# EasyEDA schematic SCH_Manta_2023-12-03.json

## Sheets
1 Sheet_1: TITLE: Sheet_1; REV: 1.0; Date: 2023-11-29; Sheet: 1/1; Drawn By: g173805; Company: Your Company
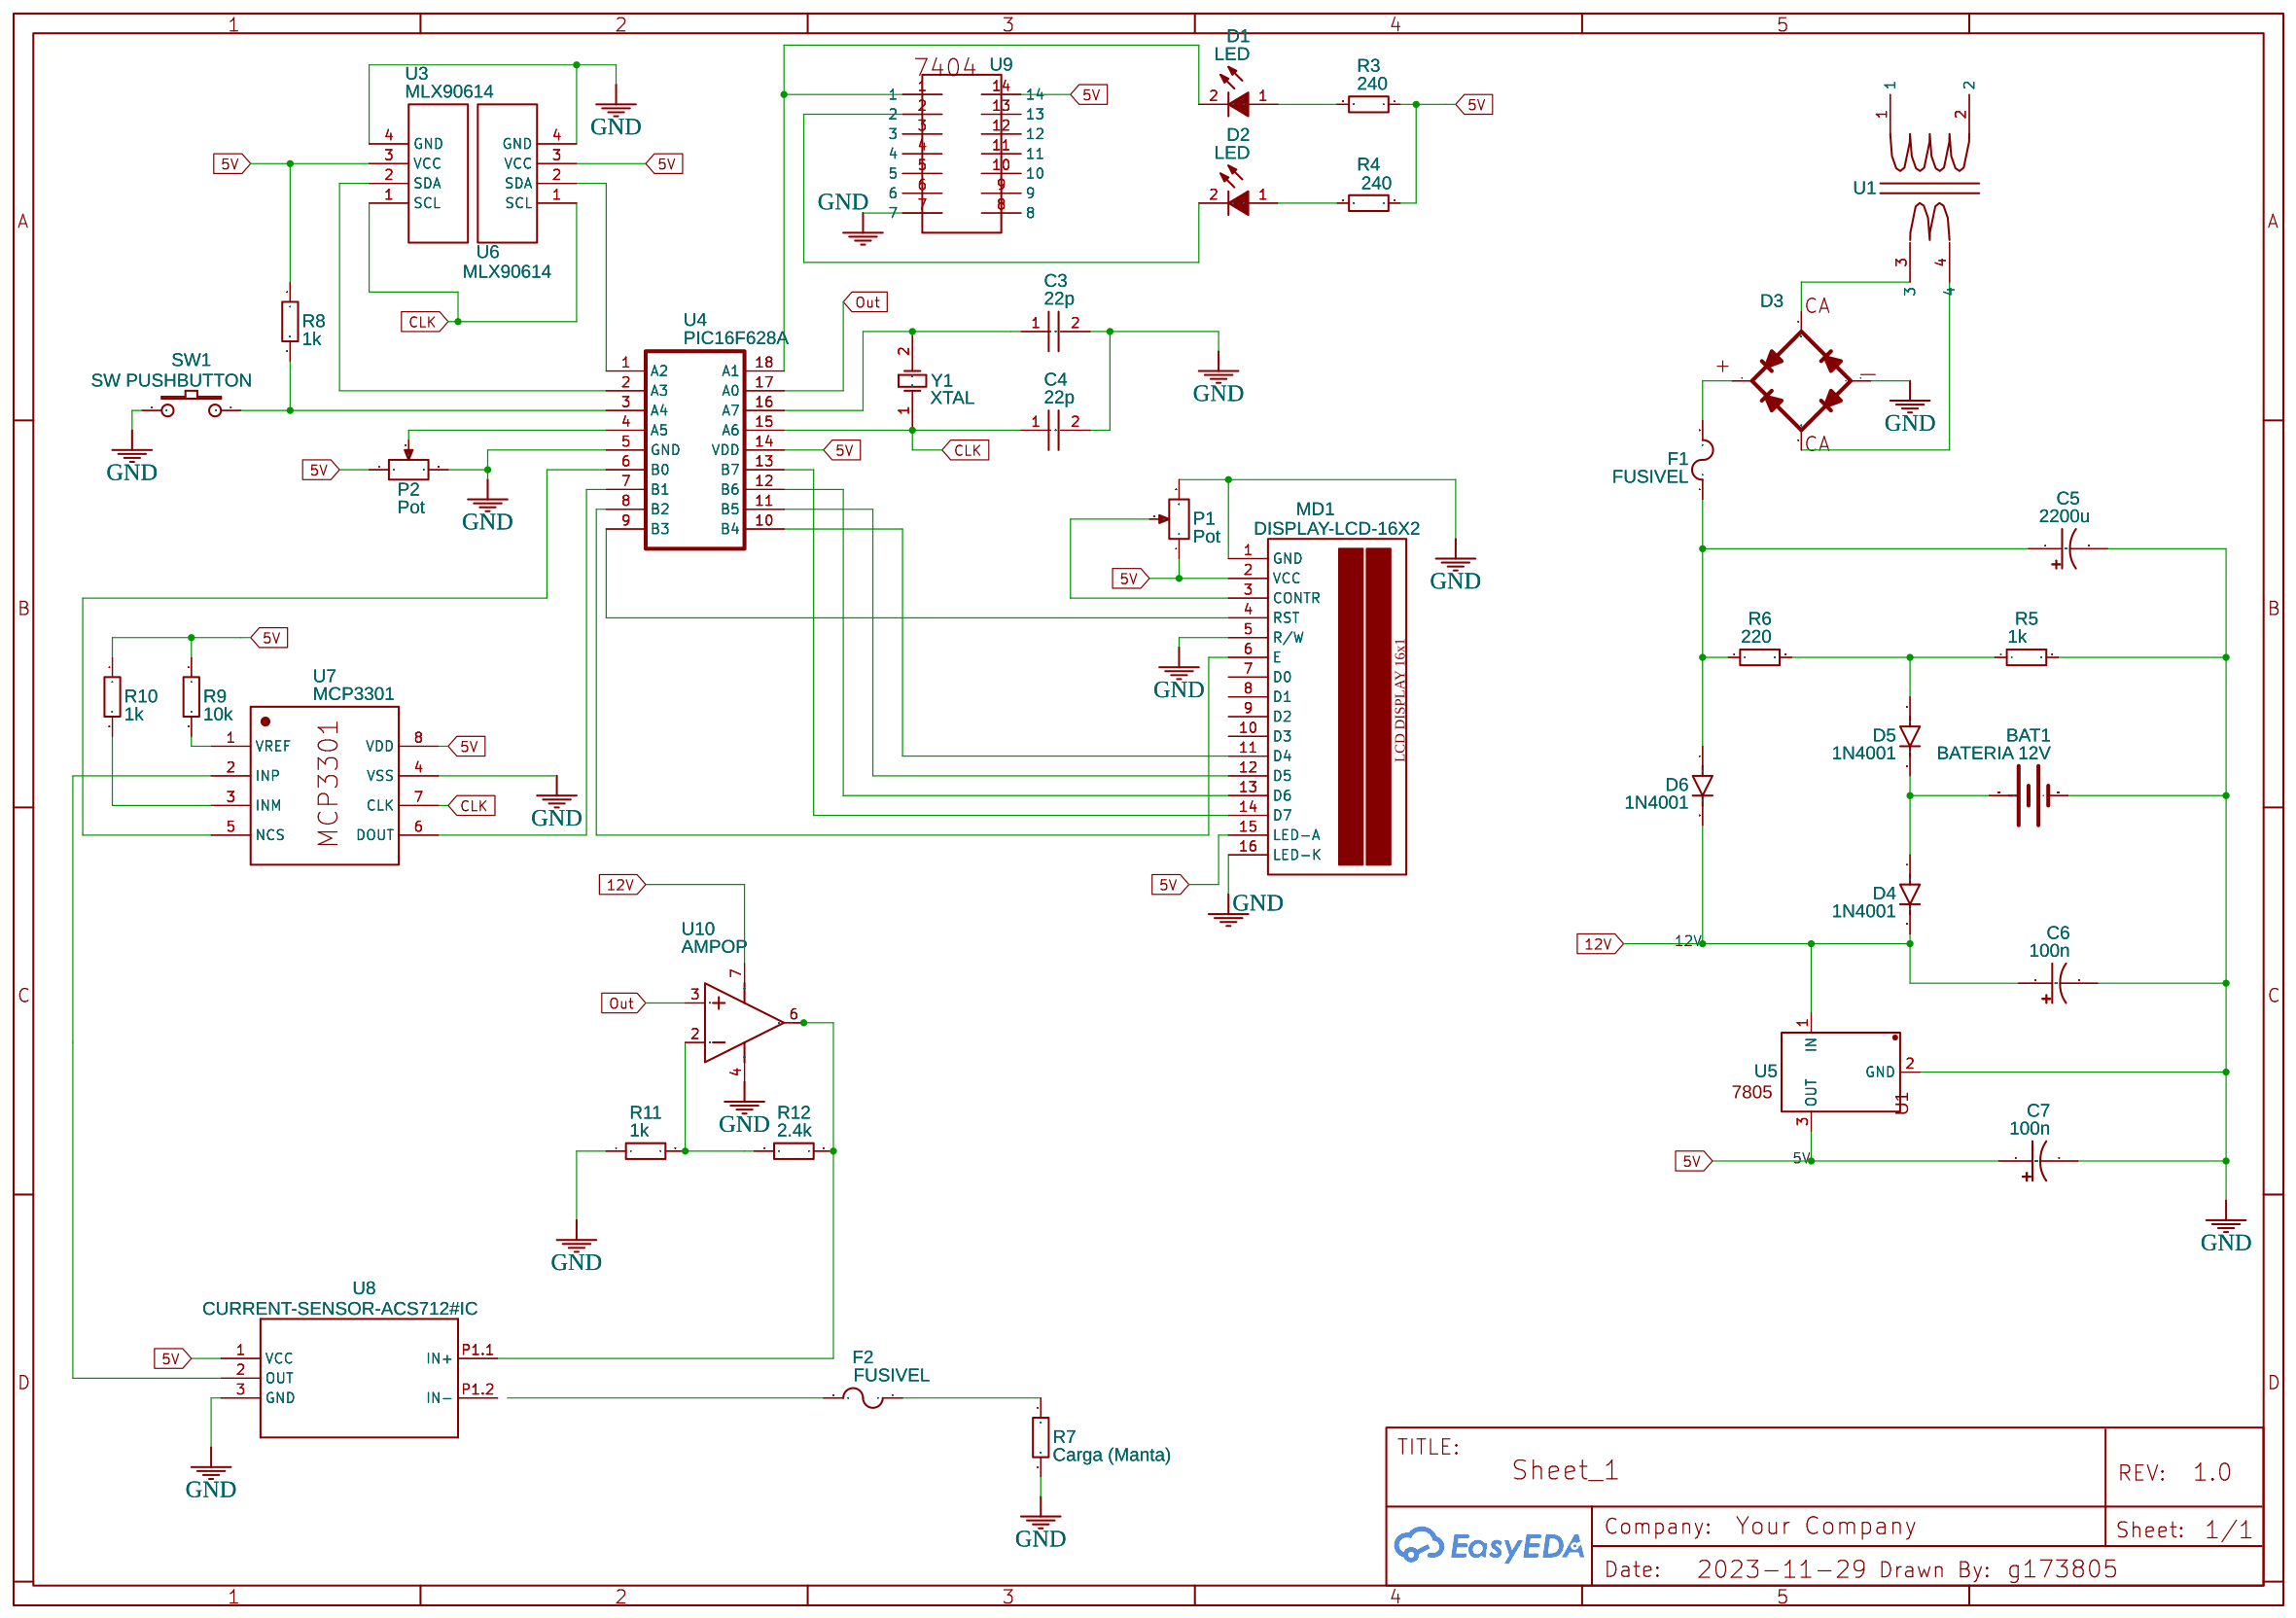
[diagram p0: Sheet_1]
2 Sheet_2
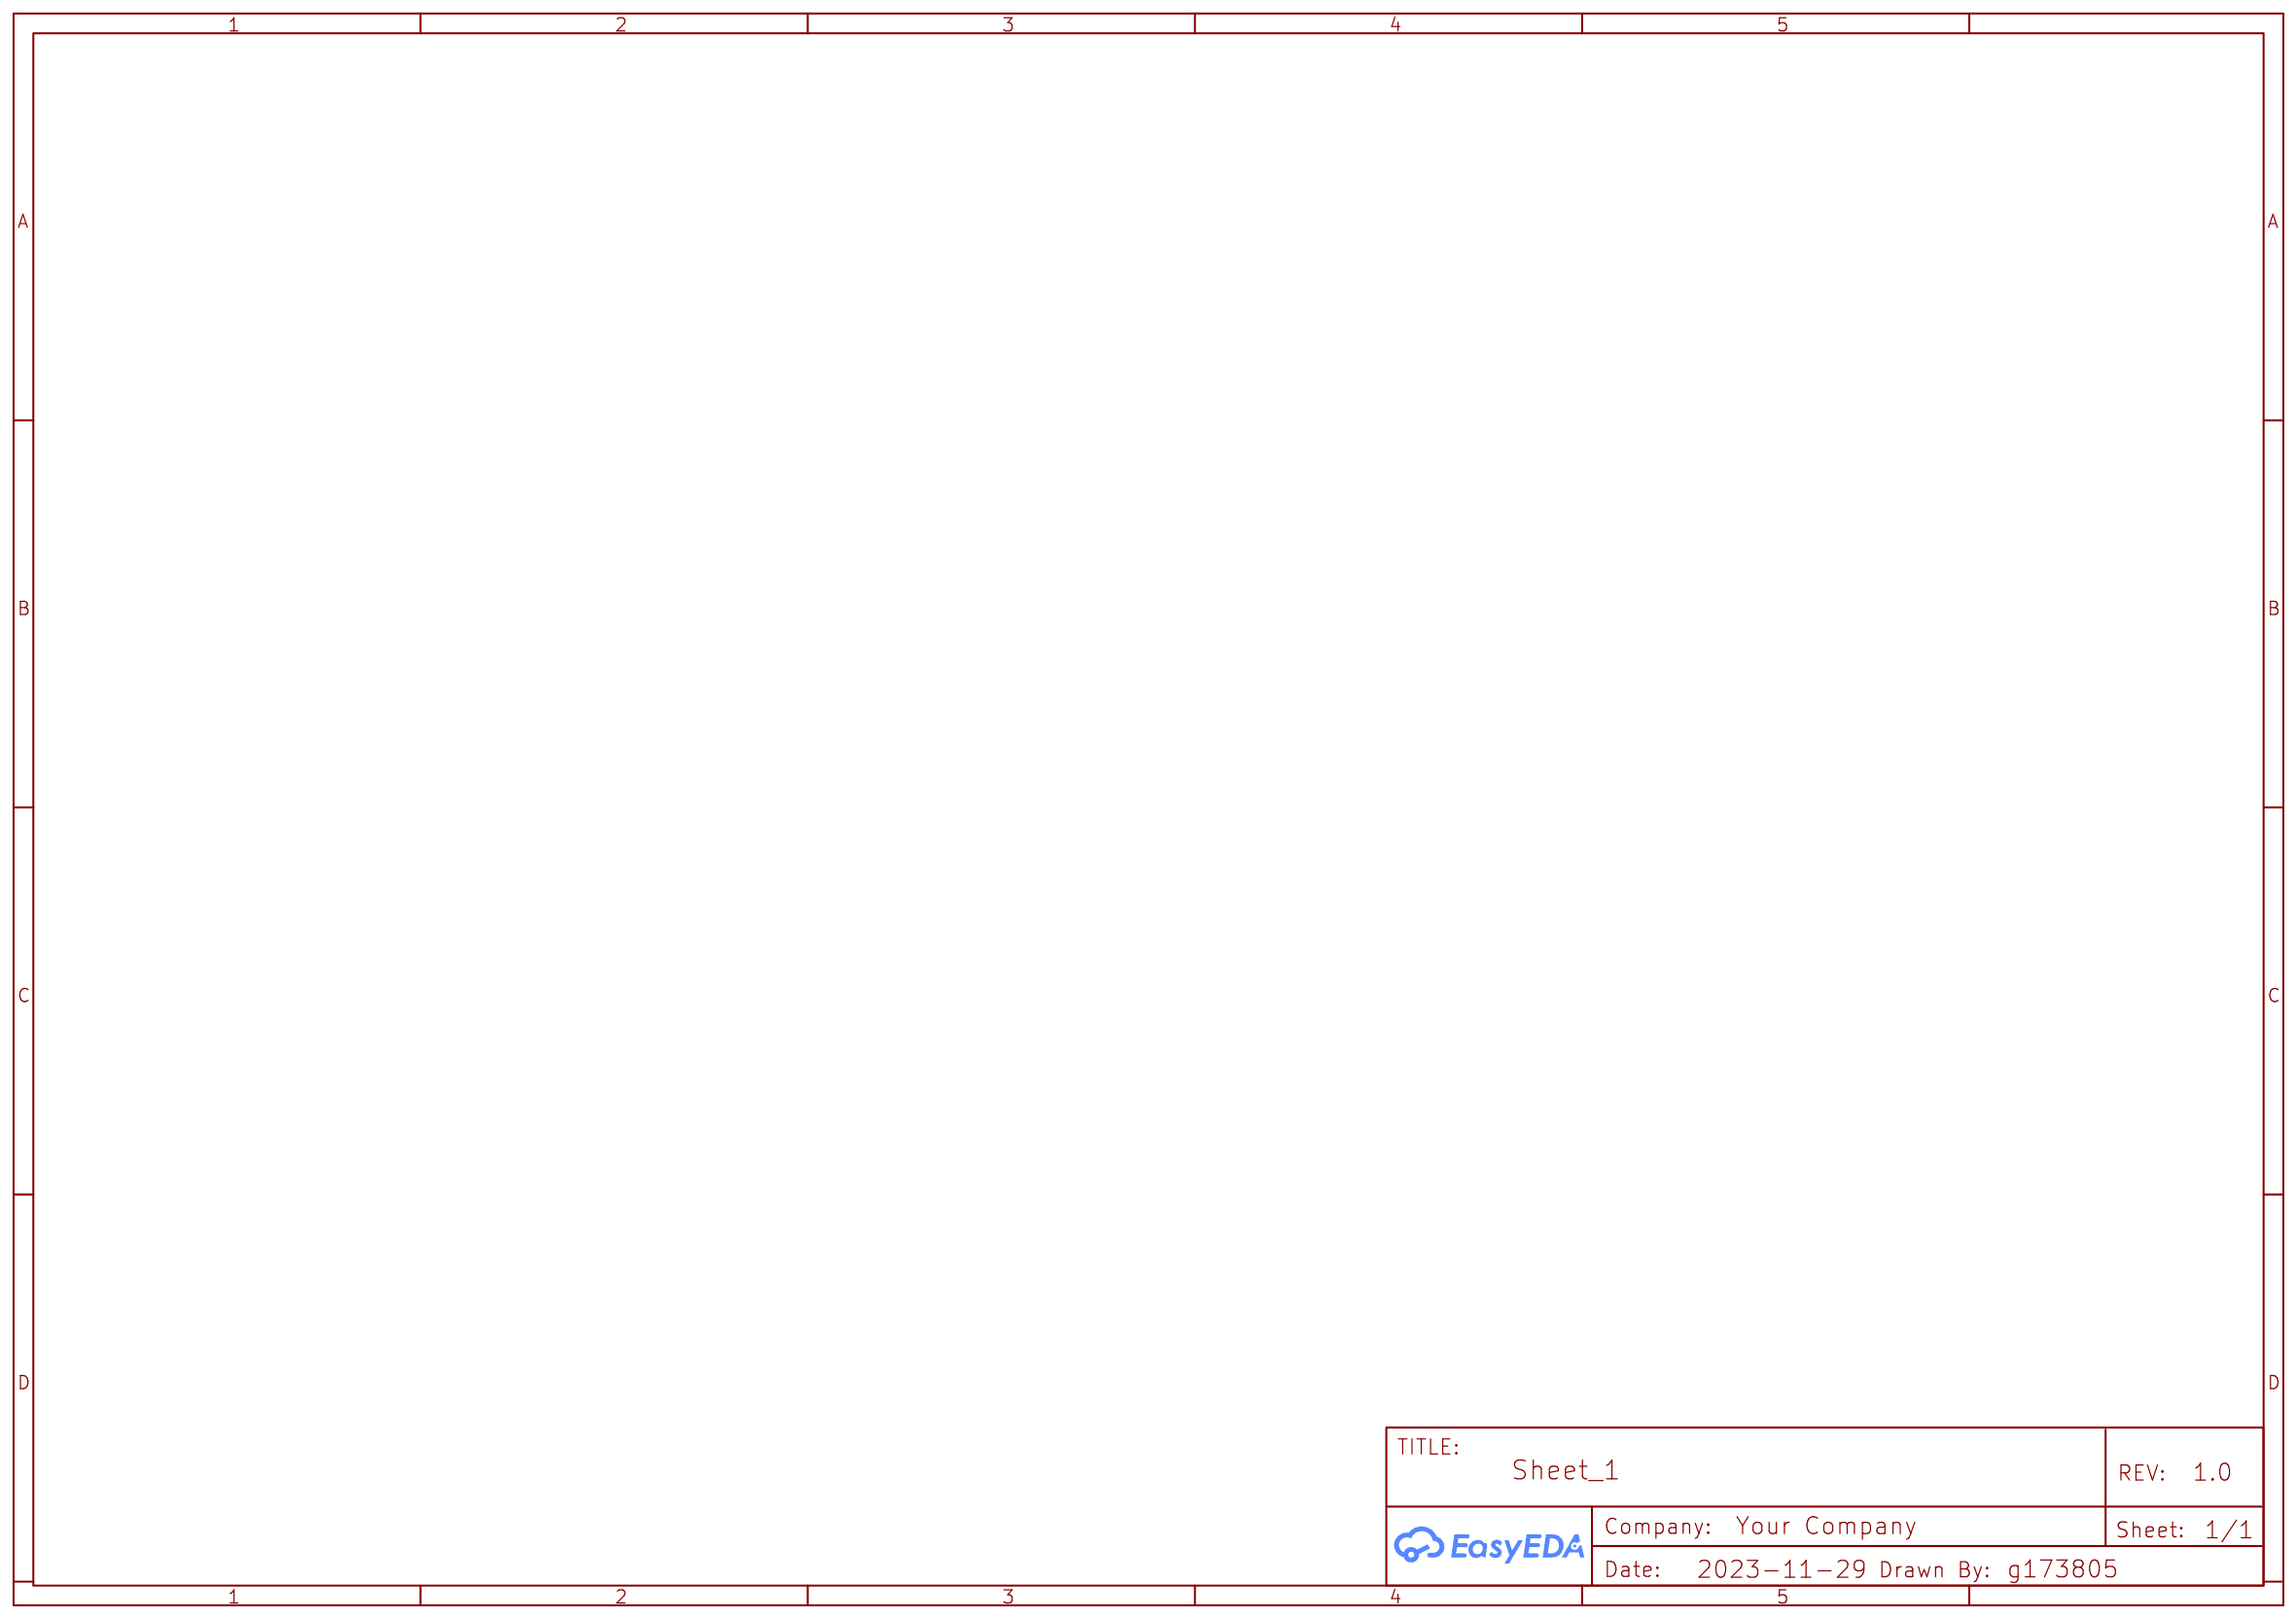
[diagram p1: Sheet_2]

## Parts
BAT1  BATERIA 12V  [BATERIA-AA-2]
C3  22p  [CAPACITOR BIPOLAR DE POLIESTER 1UF / POLYESTER BIPOLAR CAPACITOR  1UF]
C4  22p  [CAPACITOR BIPOLAR DE POLIESTER 1UF / POLYESTER BIPOLAR CAPACITOR  1UF]
C5  2200u  [CAP-TH_D1.0-BD6.3-P2.50-L-FD]
C6  100n  [CAP-TH_D1.0-BD6.3-P2.50-L-FD]
C7  100n  [CAP-TH_D1.0-BD6.3-P2.50-L-FD]
D1  LED  [LED-TH_LED-DP2-2LED-AMCC]
D2  LED  [LED-TH_LED-DP2-2LED-AMCC]
D3  PONTE RETIFICADORA  [PONTE RETIFICADORA]
D4  1N4001  [DIODO]
D5  1N4001  [DIODO]
D6  1N4001  [DIODO]
F1  FUSIVEL  [FUSIVEL]
F2  FUSIVEL  [FUSIVEL]
MD1  DISPLAY-LCD-16X2  [DISPLAY-LCD-16X2]
P1  Pot  [POTENTIOMETER BLUE]
P2  Pot  [POTENTIOMETER BLUE]
R3  240  [AXIAL-0.6]
R4  240  [AXIAL-0.6]
R5  1k  [AXIAL-0.6]
R6  220  [AXIAL-0.6]
R7  Carga (Manta)  [RESITOR DE POTENCIA]
R8  1k  [RESITOR DE POTENCIA]
R9  10k  [RESITOR DE POTENCIA]
R10  1k  [RESITOR DE POTENCIA]
R11  1k  [RESITOR DE POTENCIA]
R12  2.4k  [RESITOR DE POTENCIA]
SW1  SW PUSHBUTTON  [CHAVE-TACT]
U1  simbolo transformador  [TRANSFORMADOR]
U3  MLX90614  [MLX90614_TH_FP]
U4  PIC16F628A  [PIC16F628-18-LEAD-PDIP]
U5  7805  [7805]
U6  MLX90614  [MLX90614_TH_FP]
U7  MCP3301  [MCP3301 MSOP]
U8  CURRENT-SENSOR-ACS712#IC  [CURRENT-SENSOR-ACS712#IC]
U9  7404  [7404]
U10  AMPOP  [DIP-8WS]
Y1  XTAL  [XTAL3]

## Library data of the parts
BAT1 = BATERIA-AA-2: Contributor: SparkFun
C3 C4 = 100 UF CAPACIROR 400V: Contributor: Salomono; Convert to PCB: Yes; Add into BOM: Yes
C5-C7 = CAPACITOR: Supplier: LCSC; Supplier Part: C402592; Manufacturer: Capxon International Elec; Manufacturer Part: KM221M010E110A; Contributor: lagrenouille707
D1 D2 = LED: Supplier: Digi-Key; Manufacturer: VccLite; Manufacturer Part: 5600; Supplier Part: L20325-ND; link: https://vcclite.com/product/5602f5-5v/; Contributor: Sahr
D3 = PONTE RETIFICADORA: Contributor: maiconTzT; license: https://www.gnu.org/licenses/lgpl-2.1.html
D4-D6 = Diodo 1N4001: Supplier Part: C433778; Manufacturer: TyoHM; Manufacturer Part: RD 1/4W 10K J T/B A1; Contributor: Arixto09; LCSC Assembly: Yes; SMT Type: Extend
F1 F2 = FUSIVEL: Manufacturer Part: Glass tube fuse2A 3F 250VAC; Manufacturer: XCFuse; image: //image.lceda.cn/szlcsc/C71017.jpg; Supplier Part: C71017; LCSC Assembly: Yes; SMT Type: Extend; Paste Type: expand; Contributor: marciofaccin
MD1 = DISPLAY-LCD-16X2: Contributor: rafiif
P1 P2 = Pot_blue: Supplier Part: C61836; Contributor: Dennis van der Velde; Convert to PCB: Yes; Add into BOM: Yes
R3-R6 = Resistor Normal: Supplier: LCSC; Supplier Part: X16151710; Manufacturer: ResistorToday; Manufacturer Part: EWWR0001J20R0T9; Contributor: elviisledesma
R7-R12 = RESISTOR DE POTENCIA: Supplier: LCSC; Supplier Part: C349165; Manufacturer: ResistorToday; Manufacturer Part: EWSL3920FL200S9; Contributor: LCSC
SW1 = SW PUSHBUTTON: Contributor: AlanRamos
U1 = simbolo transformador: Contributor: mendoza.hidalgo.antonio.luis
U3 U6 = MLX90614_th: Manufacturer: Melexis; Contributor: zahirsepang
U4 = PIC16F628A: Contributor: SWC_PCB
U5 = 7805: Contributor: shreyash.sakhare
U7 = MCP3301: Contributor: PFRAN
U8 = CURRENT-SENSOR-ACS712#IC: Isolated Bipolar Current Sensors based on ACS712 chip
U9 = 7404: Contributor: patelhitarth27
U10 = AMPOP: Supplier: LCSC; Manufacturer: TI; Manufacturer Part: OP07CP; image: //image.lceda.cn/szlcsc/C5224.jpg; Supplier Part: C5224; Contributor: WSmart390
Y1 = XTAL: Crystal Oscillator

## Nets
5V: C7.1 MD1.2(VCC) MD1.15(LED-A) P1.1 P2.1 R3.1 R4.1 R8.1 R9.1 R10.1 U3.3(VCC) U4.14(VDD) U5.3(OUT) U6.3(VCC) U7.8(VDD) U8.1(VCC) U9.14
12V: C6.1 D4.2 D6.2 U5.1(IN) U10.7(VCC+)
GND: BAT1.GND@1(-) C3.2 C4.2 C5.2 C6.2 C7.2 D3.|(-) MD1.1(GND) MD1.5(R/W) MD1.16(LED-K) P1.3(2) P2.3(2) R5.2 R7.2 R11.1 SW1.1 U3.4(GND) U4.5(GND) U5.2(GND) U6.4(GND) U7.4(VSS) U8.3(GND) U9.7 U10.4(VCC-)
CLK: C4.1 U3.1(SCL) U4.15(A6) U6.1(SCL) U7.7(CLK) Y1.1(OSC1)
Out: U4.17(A0) U10.3(IN+)
Net-(BAT1-PWR@1): BAT1.PWR@1(+) D4.1 D5.2
Net-(C3-1): C3.1 U4.16(A7) Y1.2(OSC2)
Net-(C5-1): C5.1 D6.1 F1.1 R6.1
Net-(D1-1): D1.1(A) R3.2
Net-(D1-2): D1.2(K) U4.18(A1) U9.1
Net-(D2-1): D2.1(A) R4.2
Net-(D2-2): D2.2(K) U9.2
Net-(D3-+): D3.+ F1.2
Net-(D5-1): D5.1 R5.1 R6.2
Net-(F2-1): F2.1 R7.1
Net-(MD1-3): MD1.3(CONTR) P1.2(3)
Net-(MD1-4): MD1.4(RST) U4.9(B3)
Net-(MD1-6): MD1.6(E) U4.8(B2)
Net-(MD1-11): MD1.11(D4) U4.10(B4)
Net-(MD1-12): MD1.12(D5) U4.11(B5)
Net-(MD1-13): MD1.13(D6) U4.12(B6)
Net-(MD1-14): MD1.14(D7) U4.13(B7)
Net-(P2-2): P2.2(3) U4.4(A5)
Net-(R8-2): R8.2 SW1.2 U4.3(A4)
Net-(R9-2): R9.2 U7.1(VREF)
Net-(R10-2): R10.2 U7.3(INM)
Net-(R11-2): R11.2 R12.1 U10.2(IN-)
Net-(R12-2): R12.2 U8.P1.1(IN+) U10.6(OUT)
Net-(U3-2): U3.2(SDA) U4.2(A3)
Net-(U4-1): U4.1(A2) U6.2(SDA)
Net-(U4-6): U4.6(B0) U7.5(NCS)
Net-(U4-7): U4.7(B1) U7.6(DOUT)
Net-(U7-2): U7.2(INP) U8.2(OUT)

Not connected (* = marked no-connect by the designer): D3 1(CA) 2(CA); F2 2; MD1 7(D0) 8(D1) 9(D2) 10(D3); U1 1 2 3 4; U8 P1.2(IN-); U9 3 4 5 6 8 9 10 11 12 13
